# EAGLE design rtc_esp8266 (EAGLE 9.6.1)
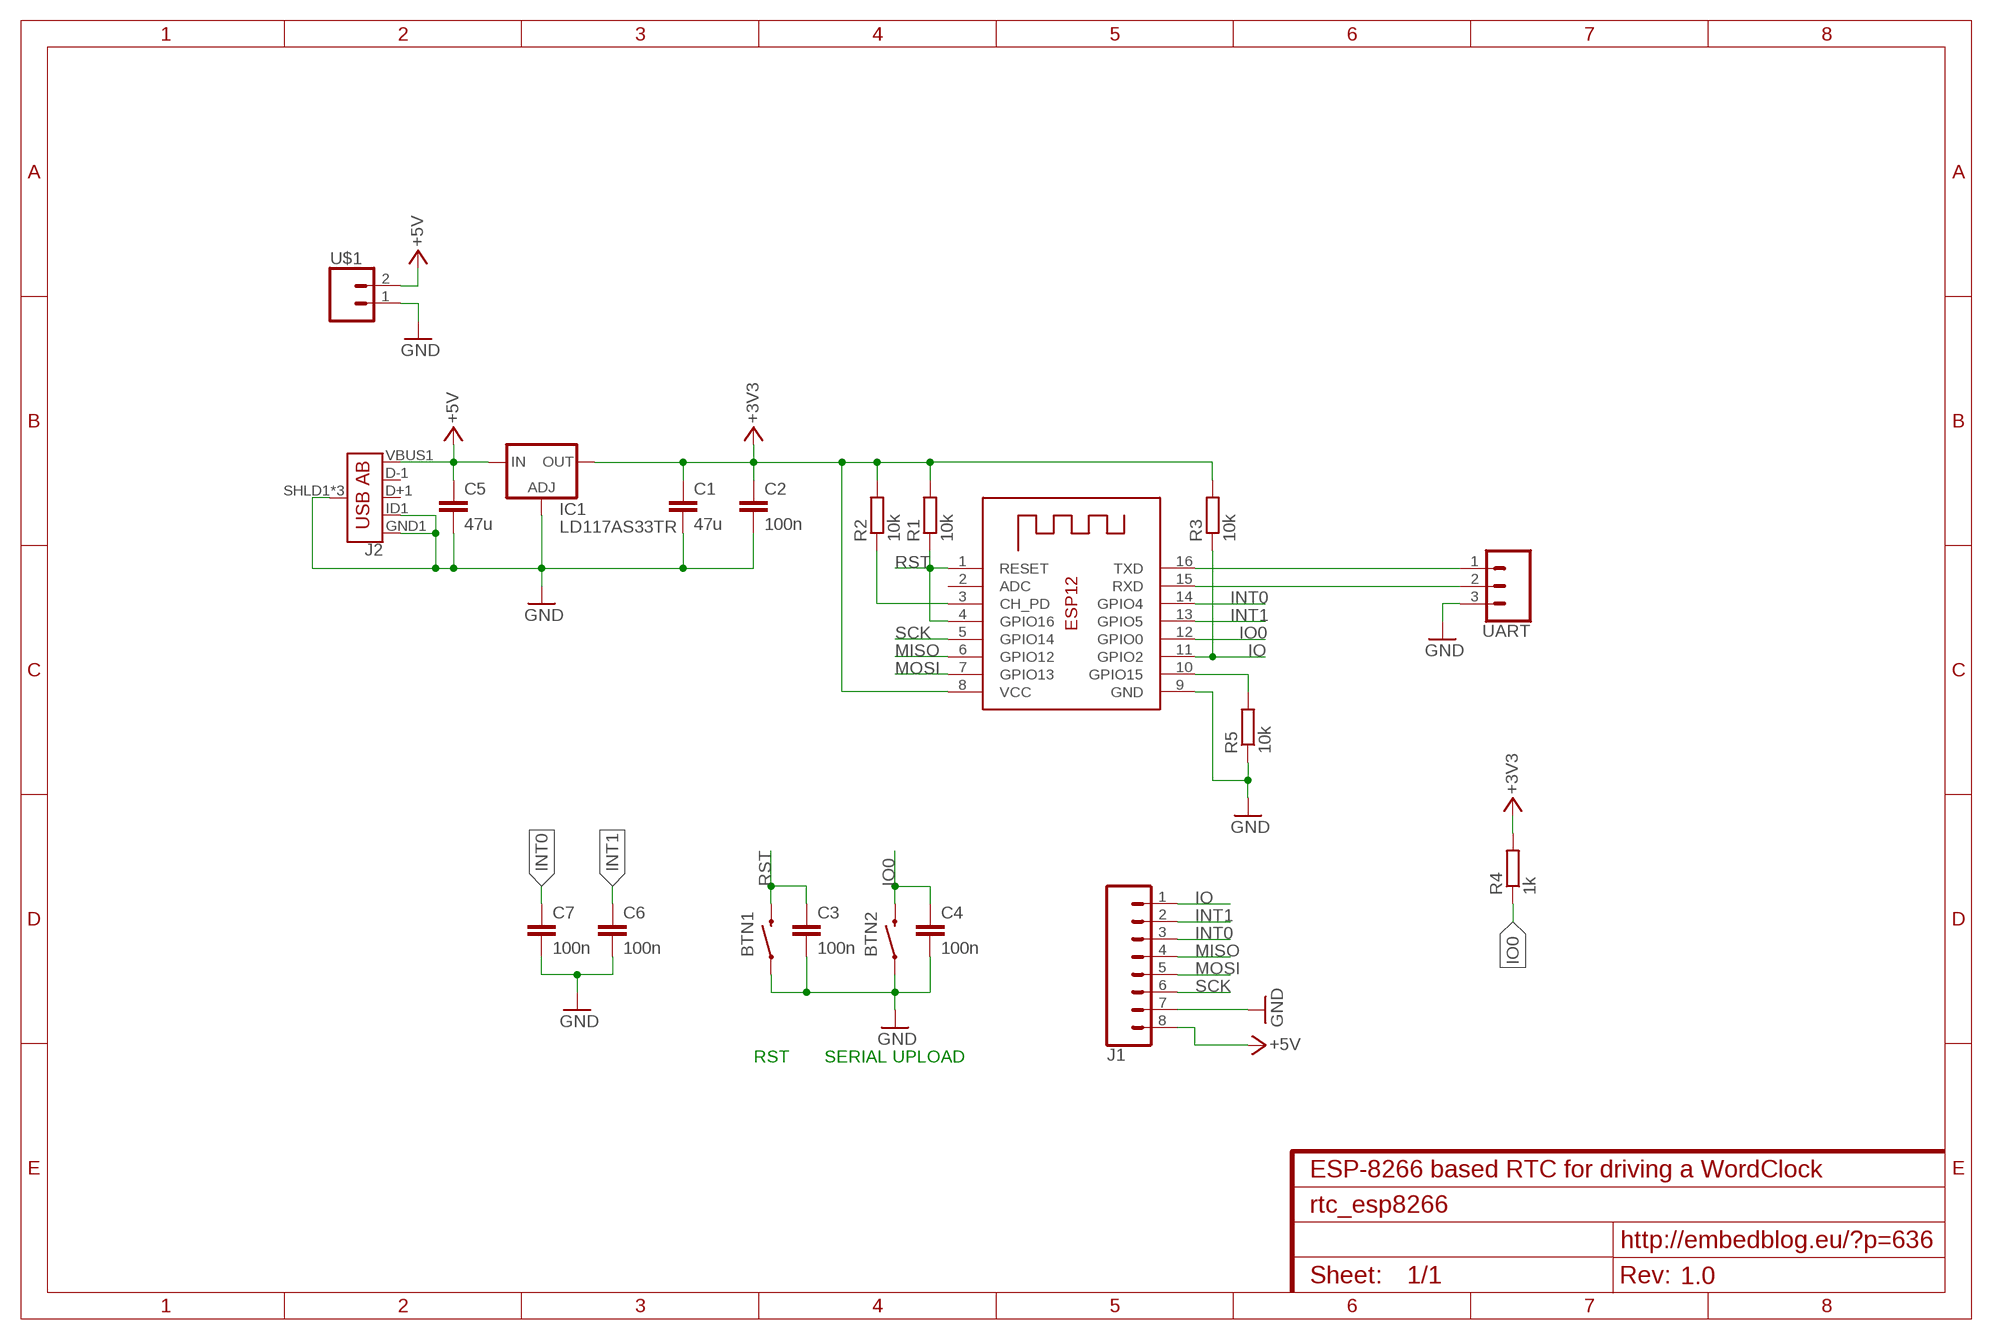
[diagram p0: schematic, sheet 1]
FRAME1 (FRAME-A4L): CNAME: ESP-8266 based RTC for driving a WordClock; CREVISION: 1.0

## Parts
BTN1  MOMENTARY-SWITCH-SPST-SMD-5.2MM  [TACTILE_SWITCH_SMD_5.2MM]
BTN2  MOMENTARY-SWITCH-SPST-SMD-5.2MM  [TACTILE_SWITCH_SMD_5.2MM]
C1  47u  C-EUC1206  [C1206]
C2  100n  C-EUC1206  [C1206]
C3  100n  C-EUC1206  [C1206]
C4  100n  C-EUC1206  [C1206]
C5  47u  C-EUC1206  [C1206]
C6  100n  C-EUC1206  [C1206]
C7  100n  C-EUC1206  [C1206]
IC1  LD117AS33TR  [SOT223]
J1  CONN_08"  [1X08]
J2  USB_AB_SMT  [USB-AB-MICRO-SMD]
R1  10k  R-EU_R1206  [R1206]
R2  10k  R-EU_R1206  [R1206]
R3  10k  R-EU_R1206  [R1206]
R4  1k  R-EU_R1206  [R1206]
R5  10k  R-EU_R1206  [R1206]
U$1  CONN_02PTH3  [1X02_LONGPADS]
UART  455-1750-1-ND  CONN_03  [1X03]
X1  ESP-12  [ESP-12]

## Nets
+3V3: C1.1 C2.1 IC1.4(OUT) R1.2 R2.2 R3.2 R4.2 X1.8(VCC)
+5V: C5.1 IC1.3(IN) J1.8 J2.VBUS1(VBUS) U$1.2
GND: BTN1.1 BTN2.1 C1.2 C2.2 C3.2 C4.2 C5.2 C6.2 C7.2 IC1.1(ADJ) J1.7 J2.GND1(GND) J2.ID1(USBID) J2.SHLD1(SHIELD) J2.SHLD2(SHIELD) J2.SHLD3(SHIELD) R5.1 U$1.1 UART.3 X1.9(GND)
INT0: C7.1 J1.3 X1.14(GPIO4)
INT1: C6.1 J1.2 X1.13(GPIO5)
IO: J1.1 R3.1 X1.11(GPIO2)
IO0: BTN2.3 C4.1 R4.1 X1.12(GPIO0)
MISO: J1.4 X1.6(GPIO12)
MOSI: J1.5 X1.7(GPIO13)
N$2: R2.1 X1.3(CH_PD)
N$6: R5.2 X1.10(GPIO15)
RST: BTN1.3 C3.1 R1.1 X1.1(RESET) X1.4(GPIO16)
RX: UART.2 X1.15(RXD)
SCK: J1.6 X1.5(GPIO14)
TX: UART.1 X1.16(TXD)
Unconnected: J2.D+1(D+) J2.D-1(D-) X1.2(ADC)

## Notes on the sheet
- RST | SERIAL UPLOAD
- http://embedblog.eu/?p=636

## Library data of the parts
BTN1 BTN2 = SparkFun-Switches:MOMENTARY-SWITCH-SPST: Momentary Switch (Pushbutton) - SPST Normally-open (NO) SPST momentary switches (buttons, pushbuttons). Variants PTH-12MM - 12mm square, through-hole Momentary Pushbutton Switch - 12mm Square <https://www.sparkfun.com/products/9190> (COM-09190) PTH-6.0MM, PTH-6.0MM-KIT - 6.0mm square, through-hole Mini Pushbutton Switch <https://www.sparkfun.com/products/97> (COM-00097) KIT package intended for soldering kit's - only one side of pads' copper is exposed. PTH-RIGHT-ANGLE-KIT - Right-angle, through-hole Right Angle Tactile Button <https://www.sparkfun.com/products/10791> - Used on SparkFun BigTime Watch Kit <https://www.sparkfun.com/products/11734> SMD-12MM - 12mm square, surface-mount Tactile Button - SMD (12mm) <https://www.sparkfun.com/products/12993> (COM-12993) Used on SparkFun PicoBoard <https://www.sparkfun.com/products/11888> SMD-4.5MM - 4.5mm Square Trackball Switch Used on SparkFun Blackberry Trackballer Breakout <https://www.sparkfun.com/products/13169> SMD-4.6MMX2.8MM - 4.60mm x 2.80mm, surface mount Used on SparkFun SAMD21 Mini Breakout <https://www.sparkfun.com/products/13664> SMD-5.2MM, SMD-5.2-REDUNDANT - 5.2mm square, surface-mount Mini Pushbutton Switch - SMD <https://www.sparkfun.com/products/8720> (COM-08720) Used on Arduino Pro Mini <https://www.sparkfun.com/products/11114> REDUNDANT package connects both switch circuits together SMD-6.0X3.5MM - 6.0 x 3.5mm, surface mount Momentary Reset Switch SMD <https://www.sparkfun.com/products/8229> (COM-08229) SMD-6.2MM-TALL - 6.2mm square, surface mount Tactile Button - SMD (6mm) <https://www.sparkfun.com/products/12992> Used on SparkFun Digital Sandbox <https://www.sparkfun.com/products/12651> SMD-RIGHT-ANGLE - Right-angle, surface mount Used on SparkFun Block for Intel® Edison - Arduino <https://www.sparkfun.com/products/13036>; PROD_ID: SWCH-08247; SF_SKU: COM-08720
C1-C7 = resistor:C-EU: CAPACITOR, European symbol
IC1 = v-reg:LD117A?*: Low drop fixed and adjustable positive voltage regulators 1 A Source: http://www.st.com/stonline/products/literature/ds/7194/ld1117axx.pdf
J1 = SparkFun-Connectors:CONN_08: Multi connection point. Often used as Generic Header-pin footprint for 0.1 inch spaced/style header connections On any of the 0.1 inch spaced packages, you can populate with these: Break Away Headers - Straight <https://www.sparkfun.com/products/116> (PRT-00116) Break Away Male Headers - Right Angle <https://www.sparkfun.com/products/553> (PRT-00553) Female Headers <https://www.sparkfun.com/products/115> (PRT-00115) Break Away Headers - Machine Pin <https://www.sparkfun.com/products/117> (PRT-00117) Break Away Female Headers - Swiss Machine Pin <https://www.sparkfun.com/products/743> (PRT-00743) Arduino Stackable Header - 8 Pin <https://www.sparkfun.com/products/9279> (PRT-09279) For SCREWTERMINALS and SPRING TERMINALS visit here: Screw Terimnals on SparkFun.com <https://www.sparkfun.com/search/results?term=Screw+Terminals> (5mm/3.5mm/2.54mm spacing) This device is also useful as a general connection point to wire up your design to another part of your project. Our various solder wires solder well into these plated through hole pads. Hook-Up Wire - Assortment (Stranded, 22 AWG) <https://www.sparkfun.com/products/11375> (PRT-11375) Hook-Up Wire - Assortment (Solid Core, 22 AWG) <https://www.sparkfun.com/products/11367> (PRT-11367) View the entire wire category on our website here <https://www.sparkfun.com/categories/141> Special notes: Molex polarized connector foot print use with SKU : PRT-08231 with associated crimp pins and housings. 1MM SMD Version SKU: PRT-10208 NOTES ON THE VARIANTS LOCK and LOCK_LONGPADS... This footprint was designed to help hold the alignment of a through-hole component (i.e. 6-pin header) while soldering it into place. You may notice that each hole has been shifted either up or down by 0.005 of an inch from it's more standard position (which is a perfectly straight line). This slight alteration caused the pins (the squares in the middle) to touch the edges of the holes. Because they are alternating, it causes a "brace" to hold the component in place. 0.005 has proven to be the perfect amount of "off-center" position when using our standard breakaway headers. Although looks a little odd when you look at the bare footprint, once you have a header in there, the alteration is very hard to notice. Also,if you push a header all the way into place, it is covered up entirely on the bottom side.; PROD_ID: CONN-08438
J2 = SparkFun-Connectors:USB_AB: USB Type AB Micro Connector OTG-compatible. 5 pins, 3 shield pins SparkFun Products: IOIO-OTG <https://www.sparkfun.com/products/13613> SparkFun SAMD21 Mini Breakout <https://www.sparkfun.com/products/13664>; PROD_ID: CONN-11794
R1-R5 = resistor:R-EU_: RESISTOR, European symbol
U$1 = SparkFun-Connectors:CONN_02: Multi connection point. Often used as Generic Header-pin footprint for 0.1 inch spaced/style header connections On any of the 0.1 inch spaced packages, you can populate with these: Break Away Headers - Straight <https://www.sparkfun.com/products/116> (PRT-00116) Break Away Male Headers - Right Angle <https://www.sparkfun.com/products/553> (PRT-00553) Female Headers <https://www.sparkfun.com/products/115> (PRT-00115) Break Away Headers - Machine Pin <https://www.sparkfun.com/products/117> (PRT-00117) Break Away Female Headers - Swiss Machine Pin <https://www.sparkfun.com/products/743> (PRT-00743) For SCREWTERMINALS and SPRING TERMINALS visit here: Screw Terimnals on SparkFun.com <https://www.sparkfun.com/search/results?term=Screw+Terminals> (5mm/3.5mm/2.54mm spacing) This device is also useful as a general connection point to wire up your design to another part of your project. Our various solder wires solder well into these plated through hole pads. Hook-Up Wire - Assortment (Stranded, 22 AWG) <https://www.sparkfun.com/products/11375> (PRT-11375) Hook-Up Wire - Assortment (Solid Core, 22 AWG) <https://www.sparkfun.com/products/11367> (PRT-11367) View the entire wire category on our website here <https://www.sparkfun.com/categories/141> Special notes: Molex polarized connector foot print use with: PRT-08233 with associated crimp pins and housings. 2.54_SCREWTERM for use with PRT-10571. 3.5mm Screw Terminal footprints for PRT-08084 5mm Screw Terminal footprints for use with PRT-08432
UART = SparkFun-Connectors:CONN_03: Multi connection point. Often used as Generic Header-pin footprint for 0.1 inch spaced/style header connections On any of the 0.1 inch spaced packages, you can populate with these: Break Away Headers - Straight <https://www.sparkfun.com/products/116> (PRT-00116) Break Away Male Headers - Right Angle <https://www.sparkfun.com/products/553> (PRT-00553) Female Headers <https://www.sparkfun.com/products/115> (PRT-00115) Break Away Headers - Machine Pin <https://www.sparkfun.com/products/117> (PRT-00117) Break Away Female Headers - Swiss Machine Pin <https://www.sparkfun.com/products/743> (PRT-00743) Stackable Header - 3 Pin (Female, 0.1") <https://www.sparkfun.com/products/13875> (PRT-13875) For SCREWTERMINALS and SPRING TERMINALS visit here: Screw Terimnals on SparkFun.com <https://www.sparkfun.com/search/results?term=Screw+Terminals> (5mm/3.5mm/2.54mm spacing) This device is also useful as a general connection point to wire up your design to another part of your project. Our various solder wires solder well into these plated through hole pads. Hook-Up Wire - Assortment (Stranded, 22 AWG) <https://www.sparkfun.com/products/11375> (PRT-11375) Hook-Up Wire - Assortment (Solid Core, 22 AWG) <https://www.sparkfun.com/products/11367> (PRT-11367) View the entire wire category on our website here <https://www.sparkfun.com/categories/141> Special notes: Molex polarized connector foot print use with SKU : PRT-08232 with associated crimp pins and housings.; PROD_ID: XXX-00000
X1 = adafruit:ESP-12

## Board
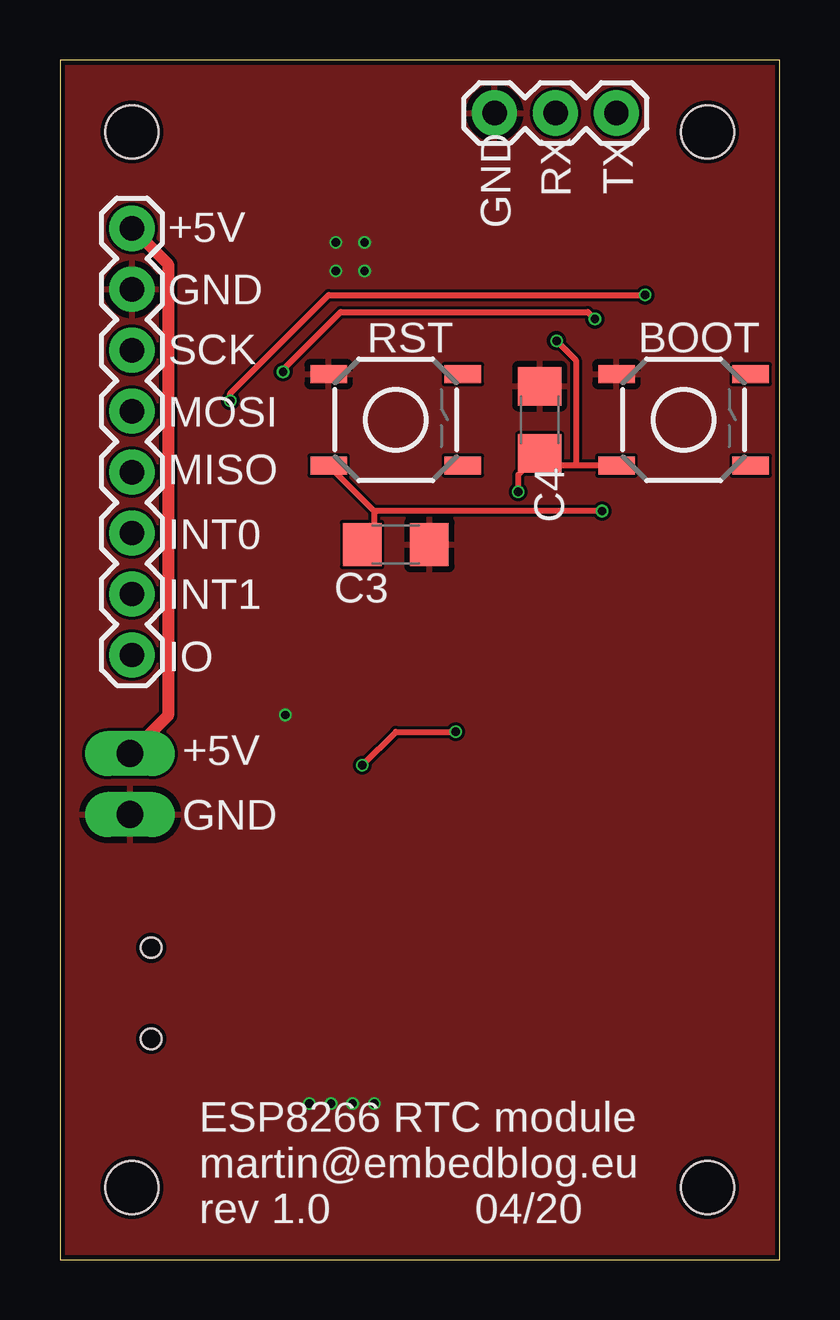
[diagram p1: board, top side]
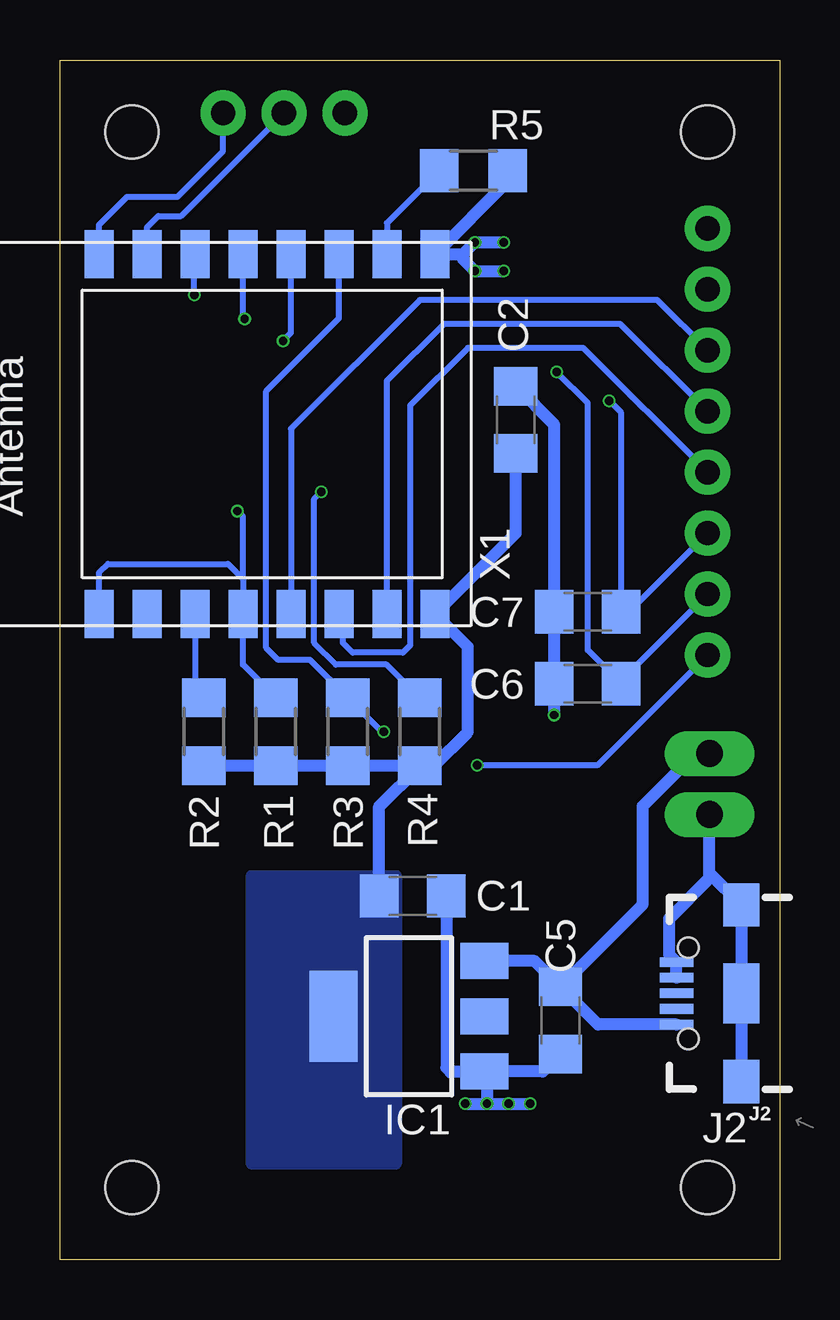
[diagram p2: board, bottom side, seen from below]

Size 30 x 50 mm. Coordinates in mm from the lower left corner, seen from the top.
Outline: 0,0 30,0 30,50 0,50 0,0
Copper layers (1*16): Top 0.035mm / dielectric 1.2mm / Bottom 0.035mm
Design rules "JLCPCB": minimum track width 5mil, minimum drill 0.3mm, track to track 5mil, track to pad 5mil, pad to pad 5mil, via to via 5mil, smd to smd 5mil, copper to edge 0.2mm, drill to drill 6mil, minimum pad ring 3mil, minimum via ring 3mil, stop-mask expansion 4mil, vias tented up to drill 0mil, thermal gap 10mil
Holes 2.2 mm at 3,3 27,3 3,47 27,47

### Footprints (pad centres in the part's own frame; a part is rotated, then mirrored left to right if it is on the bottom)
TACTILE_SWITCH_SMD_5.2MM = smd 1.524 x 0.762: 1 -2.794,1.905; 2 2.794,1.905; 3 -2.794,-1.905; 4 2.794,-1.905
C1206 = smd 1.6 x 1.8: 1 -1.4,0; 2 1.4,0
SOT223 = smd 1.5 x 2: 1 -2.3,-3.15; 2 0,-3.15; 3 2.3,-3.15 | smd 3.8 x 2: 4 0,3.15
1X08 = drill 1.016 pad 1.88: 1 0,0; 2 2.54,0; 3 5.08,0; 4 7.62,0; 5 10.16,0; 6 12.7,0; 7 15.24,0; 8 17.78,0
USB-AB-MICRO-SMD = smd 1.4 x 0.4: D+1 2.7,0; D-1 2.7,0.65; GND1 2.7,-1.3; ID1 2.7,-0.65; VBUS1 2.7,1.3 | smd 1.5 x 1.8: SHLD1 0,-3.68; SHLD2 0,3.68 | smd 1.5 x 2.5: SHLD3 0,0 | hole 0.85: 2.2,1.9; 2.2,-1.9
R1206 = smd 1.6 x 1.803: 1 -1.422,0; 2 1.422,0
1X02_LONGPADS = drill 1.118 pad 1.88 long: 1 0,0; 2 2.54,0
1X03 = drill 1.016 pad 1.88: 1 0,0; 2 2.54,0; 3 5.08,0
ESP-12 = smd 2 x 1.2: 1 -7.5,4.5; 2 -7.5,2.5; 3 -7.5,0.5; 4 -7.5,-1.5; 5 -7.5,-3.5; 6 -7.5,-5.5; 7 -7.5,-7.5; 8 -7.5,-9.5; 9 7.5,-9.5; 10 7.5,-7.5; 11 7.5,-5.5; 12 7.5,-3.5; 13 7.5,-1.5; 14 7.5,0.5; 15 7.5,2.5; 16 7.5,4.5

### Placement (x,y rotation side)
BTN1  14,35 0 top
BTN2  26,35 0 top
C1  15.29,15.16 0 bottom
C2  11,35 90 bottom
C3  14,29.8 0 top
C4  20,35 90 top
C5  9.14,9.97 270 bottom
C6  8,24 180 bottom
C7  8,27 180 bottom
IC1  15.45,10.14 90 bottom
J1  3,25.2 90 top
J2  1.6,11.1 180 bottom
R1  21,22 270 bottom
R2  24,22 270 bottom
R3  18,22 270 bottom
R4  15,22 270 bottom
R5  12.76,45.39 180 bottom
U$1  2.92,18.55 90 top
UART  23.2,47.79 180 top
X1  23.87,34.41 90 bottom

### Tracks (layer width: path | path; a pad name or v marks a point on that pad's centre or on a via)
+3V3
  Bottom 0.508: R4.2 R3.2 R1.2 R2.2 | C1.1 16.69,18.89 R4.2 | R4.2 14.42,20.58 13,22 13,25.54 X1.8 11,30.28 C2.1
  pour Bottom (isolate 0.254, no thermals): 16,16 16,4 22,4 22,16
+5V
  Top 0.508: J1.8 4.5,41.48 4.5,22.67 U$1.2
  Bottom 0.508: J2.VBUS1 7.57,9.8 C5.1 | C5.1 10.21,12.44 IC1.3 | C5.1 5.7,14.81 5.7,18.9 3.51,21.09 U$1.2
GND  (via drill 0.35)
  Bottom 0.508: J2.SHLD2 J2.SHLD3 J2.SHLD1 2.92,16.1 | 2.92,16.1 U$1.1 | J2.ID1 J2.GND1 4.6,12.7 4.6,14.2 2.92,15.88 2.92,16.1 | C5.2 9.87,7.84 IC1.1 | C1.2 13.89,7.99 13.7,7.8 13.66,7.84 IC1.1 | v13.1,6.5 v12.2,6.5 | v12.2,6.5 v11.3,6.5 v10.4,6.5 | IC1.1 12.2,7.74 v12.2,6.5 | v9.4,22.7 C6.2 C7.2 9.4,34.8 C2.2 | R5.1 11.34,44.94 X1.9 13.19,41.91 | 13.19,41.91 v12.7,42.4 v11.5,42.4 | 13.19,41.91 13.19,41.69 v12.7,41.2 v11.5,41.2
  pour Top: 0,0 30,0 30,50 0,50
INT0  (via drill 0.35)
  Top 0.254: v7.1,35.8 7.1,36.1 11.2,40.2 v24.4,40.2
  Bottom 0.254: J1.3 6.28,27 C7.1 6.6,35.3 v7.1,35.8 | v24.4,40.2 24.4,41.88 X1.14
INT1  (via drill 0.35)
  Top 0.254: v9.3,37 9.25,37.05 11.7,39.5 22,39.5 v22.3,39.2
  Bottom 0.254: J1.2 6.6,24.14 C6.1 8,25.4 8,35.7 v9.3,37 | v22.3,39.2 22.37,39.27 X1.13
IO  (via drill 0.35)
  Top 0.254: v12.6,20.6 14,22 v16.5,22
  Bottom 0.254: X1.11 18.37,39.23 21.4,36.2 21.4,25.5 20.9,25 19.58,25 R3.1 16.58,22 v16.5,22 | J1.1 7.6,20.6 v12.6,20.6
IO0  (via drill 0.35)
  Top 0.254: C4.1 20.7,34.3 | BTN2.3 21.5,33.09 | 21.5,33.09 20.5,33.09 C4.1 | C4.1 19.1,32.7 v19.1,32 | v20.7,38.3 21.5,37.5 21.5,33.09
  Bottom 0.254: R4.1 16.38,24.8 18.5,24.8 19.4,25.7 19.4,31.7 v19.1,32 | v20.7,38.3 20.37,38.63 X1.12
MISO
  Bottom 0.254: J1.4 8.18,38 13,38 15.4,35.6 15.4,25.6 15.7,25.3 17.8,25.3 18.2,25.7 18.2,26.74 X1.6
MOSI
  Bottom 0.254: J1.5 6.64,39 14,39 16.37,36.63 X1.7
N$2
  Bottom 0.254: X1.3 24.37,23.79 R2.1
N$6
  Bottom 0.254: R5.2 16.37,43.2 X1.10
RST  (via drill 0.35)
  Top 0.254: v22.6,31.2 13.1,31.2 | 13.1,31.2 BTN1.3 | 13.1,31.2 13.1,30.3 C3.1
  Bottom 0.254: X1.1 28.37,28.63 28,29 23,29 22.37,28.37 | 22.37,28.37 X1.4 22.37,24.79 R1.1 | 22.37,28.37 22.37,30.97 v22.6,31.2
RX
  Bottom 0.254: X1.15 26.37,43.03 25.9,43.5 24.95,43.5 UART.2
SCK
  Bottom 0.254: J1.6 5.1,40 15,40 20.37,34.63 X1.5
TX
  Bottom 0.254: X1.16 28.37,43.13 27.2,44.3 25.1,44.3 23.2,46.2 UART.1

### Text on the board
tPlace: RX | TX | GND | +5V | GND | RST | BOOT | SCK | MOSI | MISO | INT0 | INT1 | IO | +5V | GND | ESP8266 RTC module / martin@embedblog.eu / rev 1.0 04/20